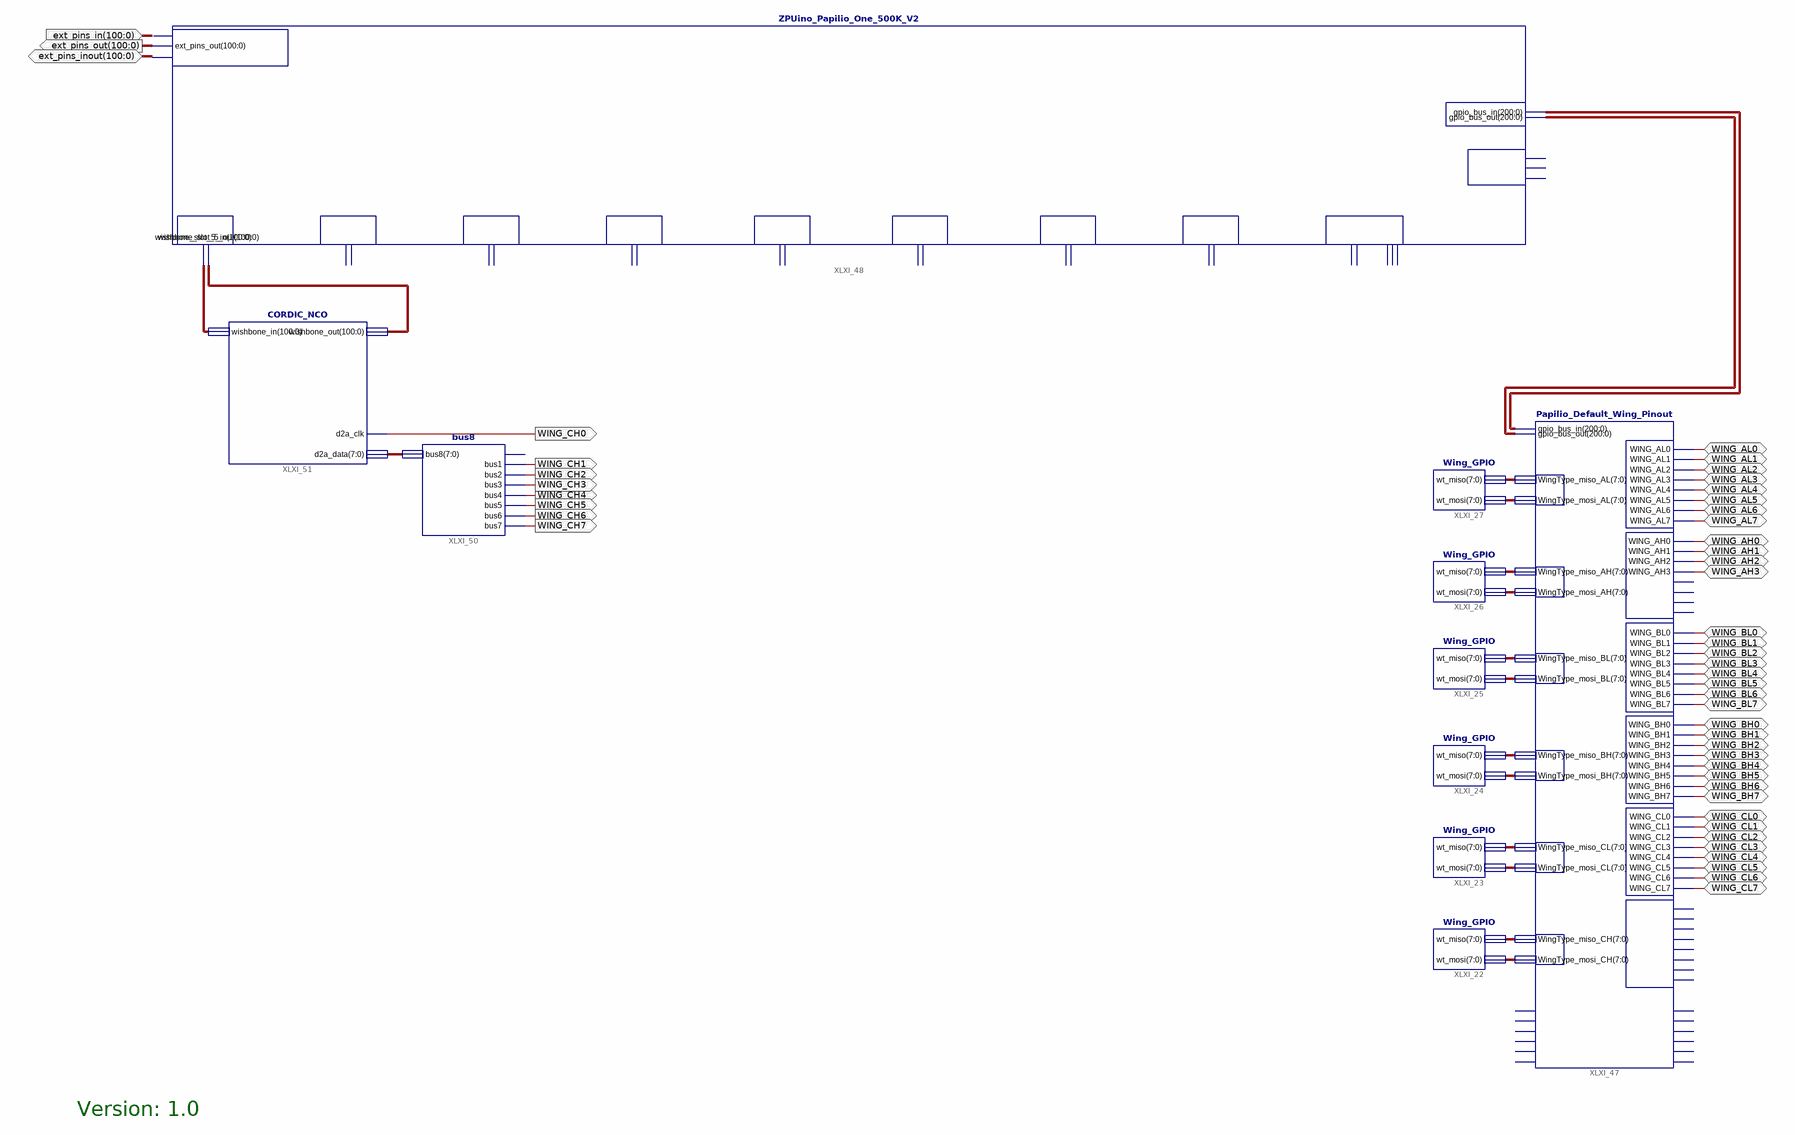
[diagram p0: schematic sheet 1]
// Xilinx ISE schematic Papilio_One_500K.sch (spartan3e) as structural Verilog: 10 symbols, 47 ports
module Papilio_One_500K (
  input  [100:0] ext_pins_in,
  inout  WING_AL0,
  inout  WING_AL1,
  inout  WING_AL2,
  inout  WING_AL3,
  inout  WING_AL4,
  inout  WING_AL5,
  inout  WING_AL6,
  inout  WING_AL7,
  inout  WING_AH0,
  inout  WING_AH1,
  inout  WING_AH2,
  inout  WING_AH3,
  inout  WING_BL0,
  inout  WING_BL1,
  inout  WING_BL2,
  inout  WING_BL3,
  inout  WING_BL4,
  inout  WING_BL5,
  inout  WING_BL6,
  inout  WING_BL7,
  inout  WING_BH0,
  inout  WING_BH1,
  inout  WING_BH2,
  inout  WING_BH3,
  inout  WING_BH4,
  inout  WING_BH5,
  inout  WING_BH6,
  inout  WING_BH7,
  inout  WING_CL0,
  inout  WING_CL1,
  inout  WING_CL2,
  inout  WING_CL3,
  inout  WING_CL4,
  inout  WING_CL5,
  inout  WING_CL6,
  inout  WING_CL7,
  inout  [100:0] ext_pins_inout,
  output [100:0] ext_pins_out,
  output WING_CH0,
  output WING_CH1,
  output WING_CH2,
  output WING_CH3,
  output WING_CH4,
  output WING_CH5,
  output WING_CH6,
  output WING_CH7
);

  wire [7:0] XLXN_325, XLXN_326, XLXN_327, XLXN_328, XLXN_329, XLXN_330, XLXN_331, XLXN_332, XLXN_333,
       XLXN_334, XLXN_335, XLXN_336, XLXN_412;
  wire [100:0] XLXN_447, XLXN_448;
  wire [200:0] XLXN_408, XLXN_409;

  Papilio_Default_Wing_Pinout XLXI_47 (
    .WING_AH0(WING_AH0), .WING_AH1(WING_AH1), .WING_AH2(WING_AH2), .WING_AH3(WING_AH3), .WING_AL0(WING_AL0),
    .WING_AL1(WING_AL1), .WING_AL2(WING_AL2), .WING_AL3(WING_AL3), .WING_AL4(WING_AL4), .WING_AL5(WING_AL5),
    .WING_AL6(WING_AL6), .WING_AL7(WING_AL7), .WING_BH0(WING_BH0), .WING_BH1(WING_BH1), .WING_BH2(WING_BH2),
    .WING_BH3(WING_BH3), .WING_BH4(WING_BH4), .WING_BH5(WING_BH5), .WING_BH6(WING_BH6), .WING_BH7(WING_BH7),
    .WING_BL0(WING_BL0), .WING_BL1(WING_BL1), .WING_BL2(WING_BL2), .WING_BL3(WING_BL3), .WING_BL4(WING_BL4),
    .WING_BL5(WING_BL5), .WING_BL6(WING_BL6), .WING_BL7(WING_BL7), .WING_CL0(WING_CL0), .WING_CL1(WING_CL1),
    .WING_CL2(WING_CL2), .WING_CL3(WING_CL3), .WING_CL4(WING_CL4), .WING_CL5(WING_CL5), .WING_CL6(WING_CL6),
    .WING_CL7(WING_CL7), .gpio_bus_out(XLXN_408), .gpio_bus_in(XLXN_409), .WingType_miso_BH(XLXN_329),
    .WingType_miso_BL(XLXN_331), .WingType_miso_AH(XLXN_333), .WingType_mosi_BL(XLXN_332),
    .WingType_mosi_BH(XLXN_330), .WingType_mosi_CL(XLXN_328), .WingType_mosi_AH(XLXN_334),
    .WingType_miso_CL(XLXN_327), .WingType_miso_CH(XLXN_325), .WingType_mosi_CH(XLXN_326),
    .WingType_mosi_AL(XLXN_336), .WingType_miso_AL(XLXN_335));  // open: WING_AH4, WING_AH5, WING_AH6, WING_AH7, WING_CH0, WING_CH1, WING_CH2, WING_CH3, WING_CH4, WING_CH5, WING_CH6, WING_CH7, Flex_Pin_out_0, Flex_Pin_out_1, Flex_Pin_out_2, Flex_Pin_out_3, Flex_Pin_out_4, Flex_Pin_out_5, Flex_Pin_in_0, Flex_Pin_in_1, Flex_Pin_in_2, Flex_Pin_in_3, Flex_Pin_in_4, Flex_Pin_in_5
  Wing_GPIO XLXI_22 (.wt_miso(XLXN_325), .wt_mosi(XLXN_326));
  Wing_GPIO XLXI_23 (.wt_miso(XLXN_327), .wt_mosi(XLXN_328));
  Wing_GPIO XLXI_24 (.wt_miso(XLXN_329), .wt_mosi(XLXN_330));
  Wing_GPIO XLXI_25 (.wt_miso(XLXN_331), .wt_mosi(XLXN_332));
  Wing_GPIO XLXI_26 (.wt_miso(XLXN_333), .wt_mosi(XLXN_334));
  Wing_GPIO XLXI_27 (.wt_miso(XLXN_335), .wt_mosi(XLXN_336));
  ZPUino_Papilio_One_500K_V2 XLXI_48 (
    .ext_pins_in(ext_pins_in), .ext_pins_out(ext_pins_out), .ext_pins_inout(ext_pins_inout),
    .gpio_bus_out(XLXN_408), .gpio_bus_in(XLXN_409), .wishbone_slot_5_out(XLXN_448),
    .wishbone_slot_5_in(XLXN_447));  // open: clk_96Mhz, clk_1Mhz, clk_osc_32Mhz, wishbone_slot_6_in, wishbone_slot_6_out, wishbone_slot_8_in, wishbone_slot_8_out, wishbone_slot_9_in, wishbone_slot_9_out, wishbone_slot_10_in, wishbone_slot_10_out, wishbone_slot_11_in, wishbone_slot_11_out, wishbone_slot_12_in, wishbone_slot_12_out, wishbone_slot_13_in, wishbone_slot_13_out, wishbone_slot_14_in, wishbone_slot_14_out, wishbone_slot_video_in, wishbone_slot_video_out, vgaclkout
  CORDIC_NCO XLXI_51 (.wishbone_in(XLXN_447), .d2a_clk(WING_CH0), .wishbone_out(XLXN_448), .d2a_data(XLXN_412));
  bus8 XLXI_50 (
    .bus8(XLXN_412), .bus1(WING_CH1), .bus2(WING_CH2), .bus3(WING_CH3), .bus4(WING_CH4), .bus5(WING_CH5),
    .bus6(WING_CH6), .bus7(WING_CH7));  // open: bus0

  // Notes on the sheet:
  //   Version: 1.0
endmodule
